# Altium schematic sheet GroundsCoupling.SchDoc: FMC SDR Transceiver Board
size 420 x 297 mm; CheckedBy: -; CompanyName: CERN; DrawnBy: DrawnBy; Organization: CERN; Address1: European Organization for Nuclear Research; Address2: CH-1211 Genčve 23 - Switzerland; Revision: -; SheetNumber: -; SheetTotal: -; EDA_Number: EDA-XXXXX-VX-X; Projet: -; ModifiedBy: -; CreateDate: XX/XX/XXXX; CheckedDate: -; Title2: Shield Coupling; DivGrp: TE/MPE; Designer: Designer; ModifiedDate: -
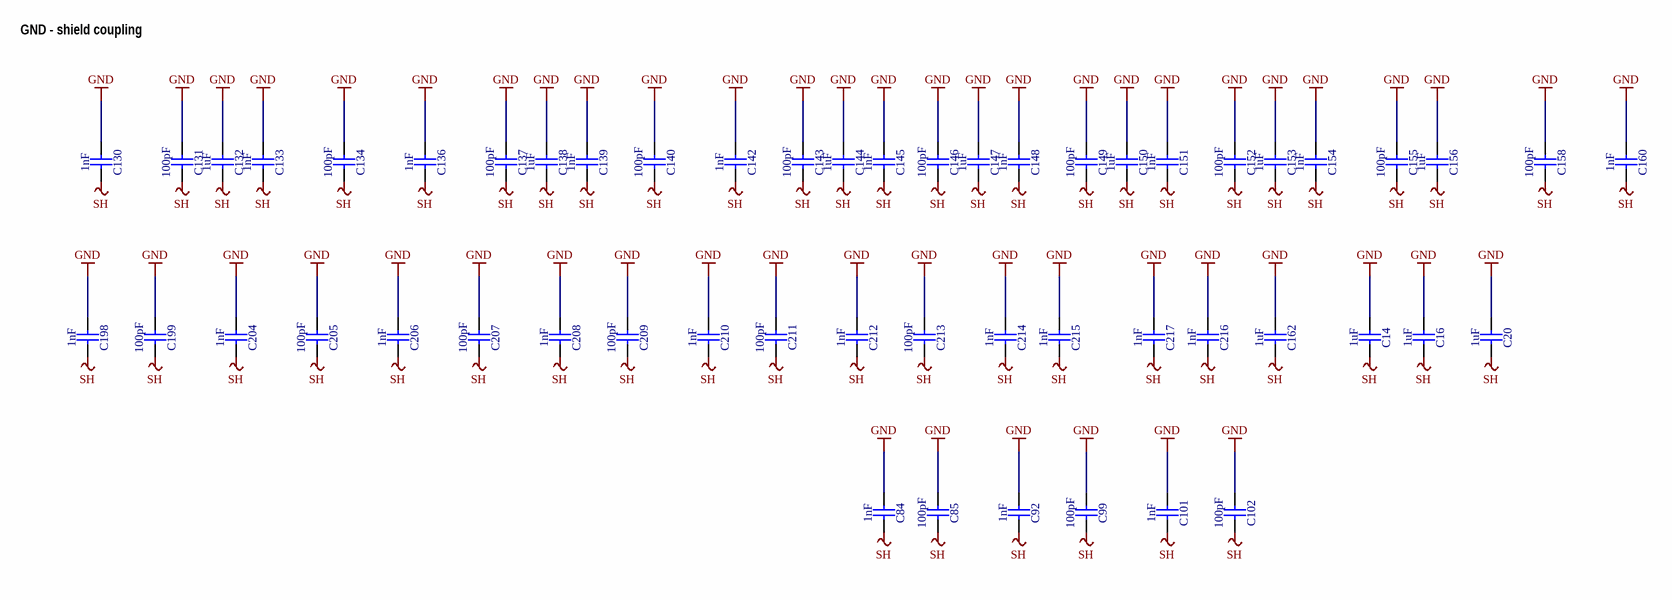
[diagram p0: GroundsCoupling.SchDoc]

## Parts
C14  1uF  [CAPC3216X140N]
C16  1uF  [CAPC3216X140N]
C20  1uF  [CAPC3216X140N]
C84  1nF  [CAPC1005X55N]
C85  100pF  [CAPC1005X55N]
C92  1nF  [CAPC1005X55N]
C99  100pF  [CAPC1005X55N]
C101  1nF  [CAPC1005X55N]
C102  100pF  [CAPC1005X55N]
C130  1nF  [CAPC1005X55N]
C131  100pF  [CAPC1005X55N]
C132  1uF  [CAPC3216X140N]
C133  1nF  [CAPC1005X55N]
C134  100pF  [CAPC1005X55N]
C136  1nF  [CAPC1005X55N]
C137  100pF  [CAPC1005X55N]
C138  1uF  [CAPC3216X140N]
C139  1nF  [CAPC1005X55N]
C140  100pF  [CAPC1005X55N]
C142  1nF  [CAPC1005X55N]
C143  100pF  [CAPC1005X55N]
C144  1uF  [CAPC3216X140N]
C145  1nF  [CAPC1005X55N]
C146  100pF  [CAPC1005X55N]
C147  1uF  [CAPC3216X140N]
C148  1nF  [CAPC1005X55N]
C149  100pF  [CAPC1005X55N]
C150  1uF  [CAPC3216X140N]
C151  1nF  [CAPC1005X55N]
C152  100pF  [CAPC1005X55N]
C153  1uF  [CAPC3216X140N]
C154  1nF  [CAPC1005X55N]
C155  100pF  [CAPC1005X55N]
C156  1uF  [CAPC3216X140N]
C158  100pF  [CAPC1005X55N]
C160  1nF  [CAPC1005X55N]
C162  1uF  [CAPC3216X140N]
C198  1nF  [CAPC1005X55N]
C199  100pF  [CAPC1005X55N]
C204  1nF  [CAPC1005X55N]
C205  100pF  [CAPC1005X55N]
C206  1nF  [CAPC1005X55N]
C207  100pF  [CAPC1005X55N]
C208  1nF  [CAPC1005X55N]
C209  100pF  [CAPC1005X55N]
C210  1nF  [CAPC1005X55N]
C211  100pF  [CAPC1005X55N]
C212  1nF  [CAPC1005X55N]
C213  100pF  [CAPC1005X55N]
C214  1nF  [CAPC1005X55N]
C215  1nF  [CAPC1005X55N]
C216  1nF  [CAPC1005X55N]
C217  1nF  [CAPC1005X55N]

## Nets
GND: C14.1 C16.1 C20.1 C84.1 C85.1 C92.1 C99.1 C101.1 C102.1 C130.1 C131.1 C132.1 C133.1 C134.1 C136.1 C137.1 C138.1 C139.1 C140.1 C142.1 C143.1 C144.1 C145.1 C146.1 C147.1 C148.1 C149.1 C150.1 C151.1 C152.1 C153.1 C154.1 C155.1 C156.1 C158.1 C160.1 C162.1 C198.1 C199.1 C204.1 C205.1 C206.1 C207.1 C208.1 C209.1 C210.1 C211.1 C212.1 C213.1 C214.1 C215.1 C216.1 C217.1
SH: C14.2 C16.2 C20.2 C84.2 C85.2 C92.2 C99.2 C101.2 C102.2 C130.2 C131.2 C132.2 C133.2 C134.2 C136.2 C137.2 C138.2 C139.2 C140.2 C142.2 C143.2 C144.2 C145.2 C146.2 C147.2 C148.2 C149.2 C150.2 C151.2 C152.2 C153.2 C154.2 C155.2 C156.2 C158.2 C160.2 C162.2 C198.2 C199.2 C204.2 C205.2 C206.2 C207.2 C208.2 C209.2 C210.2 C211.2 C212.2 C213.2 C214.2 C215.2 C216.2 C217.2

## Notes on the sheet
- GND - shield coupling
- Project/Equipment
- Document
- Designer
- Drawn by
- Check.by
- File
- Last Mod.
- Print Date
- Sheet
- Size
- A3
- of
- Rev

## Library data of the parts
C14 C16 C20 C132 C138 C144 C147 C150 C153 C156 C162 = CC1206_1UF_50V_10%_X7R: Non-polarised capacitor; Part Description: SMD Multilayer Chip Ceramic Capacitor; Manufacturer: GENERIC; Manufacturer1 Part Number: C1206F105K5RACTU; Voltage: 50V; TC: X7R; Tolerance: ±10%; Part Number: CC1206_1UF_50V_10%_X7R; Component Kind: Standard; Component Type: Standard; Pin Count: 2; Value: 1uF; Status: Preferred; Manufacturer Part Number: CC1206_1UF_50V_10%_X7R; Case: 1206; Mounted: Yes; Socket: No; SMD: Yes; Sense: No; Manufacturer1 Example: KEMET; Manufacturer1 ComponentHeight: 1.8mm; HelpURL: \\cern.ch\dfs\Applications\Altium\Datasheets\CC1206_X7R_KEMET_OPENMODE.pdf; Author: CERN DEM JLC; CreateDate: 07.11.2012; LatestRevisionDate: 07.11.2012
C84 C92 C101 C130 C133 C136 C139 C142 C145 C148 C151 C154 C160 C198 C204 C206 C208 C210 C212 C214-C217 = CC0402_1NF_50V_10%_X7R: Non-polarised capacitor; Part Description: SMD Multilayer Chip Ceramic Capacitor; Manufacturer: GENERIC; Manufacturer1 Part Number: 223858715623; Voltage: 50V; TC: X7R; Tolerance: ±10%; Part Number: CC0402_1NF_50V_10%_X7R; Component Kind: Standard; Component Type: Standard; Pin Count: 2; Value: 1nF; Status: Not Recommended; Manufacturer Part Number: CC0402_1NF_50V_10%_X7R; Case: 0402; Mounted: Yes; Socket: No; SMD: Yes; Sense: No; Manufacturer1 Example: PHYCOMP; Manufacturer1 ComponentHeight: 0.55mm; HelpURL: \\cern.ch\dfs\Applications\Altium\Datasheets\CC0402_X7R_PHYCOMP.pdf; Author: CERN DEM JLC; CreateDate: 03.12.2007; LatestRevisionDate: 03.12.2007
C85 C99 C102 C131 C134 C137 C140 C143 C146 C149 C152 C155 C158 C199 C205 C207 C209 C211 C213 = CC0402_100PF_50V_5%_C0G: Non-polarised capacitor; Part Description: SMD Multilayer Chip Ceramic Capacitor; Manufacturer: GENERIC; Manufacturer1 Part Number: C0402C101J5GACTU; Voltage: 50V; TC: C0G/NP0; Tolerance: ±5%; Part Number: CC0402_100PF_50V_5%_C0G; Component Kind: Standard; Component Type: Standard; Pin Count: 2; Value: 100pF; Status: Preferred; Manufacturer Part Number: CC0402_100PF_50V_5%_C0G; Case: 0402; Mounted: Yes; Socket: No; SMD: Yes; Sense: No; Manufacturer1 Example: KEMET; Manufacturer1 ComponentHeight: 0.55mm; HelpURL: \\cern.ch\dfs\Applications\Altium\Datasheets\CC0805_C0G_KEMET_(Commercial Grade).pdf; Author: CERN DEM JLC; CreateDate: 03.12.2007; LatestRevisionDate: 22.04.2015